# Altium project Speaker Mic Comms.PrjPcb
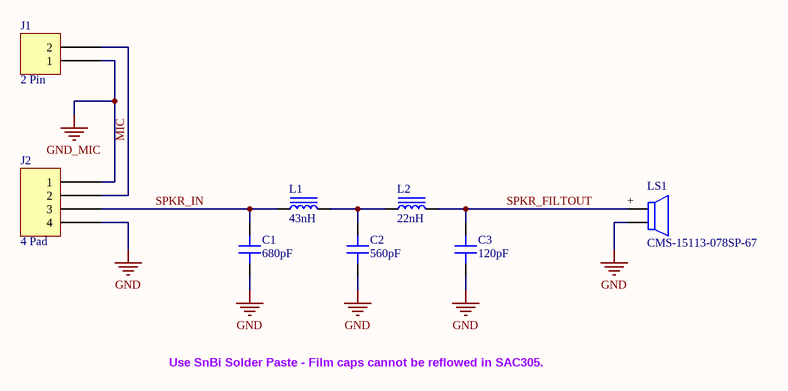
[diagram p0: Mic Speaker Interconn.SchDoc]
1 sheet, 8 parts. Net scope: global (net labels, ports and power ports of the same name join across sheets).
Board file: Mic Speaker Interconnect.PcbDoc

## Sheet Mic Speaker Interconn.SchDoc: Microphone and Speaker Interconnect
size A4

### Parts
C1  680pF  [CAP FILM 0603_1608]
C2  560pF  [CAP FILM 0603_1608]
C3  120pF  [CAP FILM 0603_1608]
J1  2 Pin  [Mic2Board]
J2  4 Pad  [Wire2Board]
L1  43nH  [IND 0603_1608 RF WW]
L2  22nH  [IND 0603_1608 RF WW]
LS1  CMS-15113-078SP-67  [CUI CMS-15113-078SP]

### Nets
GND: C1.1 C2.1 C3.1 J2.4 LS1.-
GND_MIC: J1.1 J2.1
MIC: J1.2 J2.2
SPKR_FILTOUT: C3.2 L2.2 LS1.+
SPKR_IN: C1.2 J2.3 L1.1
NetC2_2: C2.2 L1.2 L2.1

### Notes on the sheet
- Use SnBi Solder Paste - Film caps cannot be reflowed in SAC305.
- Title
- Size:
- Date:
- A4
- Number:
- Time:
- Revision:
- Sheet
- of
- File:

### Library data of the parts
C1 = ECH-U1C681GX5: CAP FILM 680PF 2% 16VDC 0603; Manufacturer: Panasonic Electronic Components; Dielectric Material: Polyphenylene Sulfide (PPS), Metallized - Stacked; Voltage Rating - DC: 16V; Part Number: ECH-U1C681GX5; Applications: General Purpose; Capacitance: 680pF; ComponentLink1Description: Datasheet; ComponentLink1URL: http://industrial.panasonic.com/www-cgi/jvcr13pz.cgi?E+PZ+3+ABD0013+ECHU1C681GX5+7+WW; ComponentLink2Description: DigiKey Link; ComponentLink2URL: http://digikey.com/product-detail/en/panasonic-electronic-components/ECH-U1C681GX5/PCF1451CT-ND/431710; Device Package: 0603 (1608 Metric); Height - Seated (Max): 0.033" (0.85mm); LastUpdated: 06/09/2020 12:17:15; Lifecycle Status: Active; Minimum Order: 1; Mounting Type: Surface Mount; Operating Temperature: -55°C ~ 125°C; Package / Case: 0603 (1608 Metric); Packaging: TapeAndReel; Part Status: Active; Price: 0.11; Series: ECH-U(X); Size / Dimension: 0.063" L x 0.031" W (1.60mm x 0.80mm); Supplier 1: DigiKey; Supplier Part Number 1: PCF1451CT-ND; Termination: Solder Pads; Tolerance: ±2%; Value: 680pF
C2 = ECH-U1C561JX5: CAP FILM 560PF 5% 16VDC 0603; Manufacturer: Panasonic Electronic Components; Dielectric Material: Polyphenylene Sulfide (PPS), Metallized - Stacked; Voltage Rating - DC: 16V; Part Number: ECH-U1C561JX5; Applications: General Purpose; Capacitance: 560pF; ComponentLink1Description: Datasheet; ComponentLink1URL: http://industrial.panasonic.com/www-cgi/jvcr13pz.cgi?E+PZ+3+ABD0013+ECHU1C561JX5+7+WW; ComponentLink2Description: DigiKey Link; ComponentLink2URL: http://digikey.com/product-detail/en/panasonic-electronic-components/ECH-U1C561JX5/PCF1468CT-ND/431709; Device Package: 0603 (1608 Metric); Height - Seated (Max): 0.033" (0.85mm); LastUpdated: 06/09/2020 12:17:15; Lifecycle Status: Active; Minimum Order: 1; Mounting Type: Surface Mount; Operating Temperature: -55°C ~ 125°C; Package / Case: 0603 (1608 Metric); Packaging: TapeAndReel; Part Status: Active; Price: 0.12; Series: ECH-U(X); Size / Dimension: 0.063" L x 0.031" W (1.60mm x 0.80mm); Supplier 1: DigiKey; Supplier Part Number 1: PCF1468CT-ND; Termination: Solder Pads; Tolerance: ±5%; Value: 560pF
C3 = ECH-U1C121JX5: CAP FILM 120PF 5% 16VDC 0603; Manufacturer: Panasonic Electronic Components; Dielectric Material: Polyphenylene Sulfide (PPS), Metallized - Stacked; Voltage Rating - DC: 16V; Part Number: ECH-U1C121JX5; Applications: General Purpose; Capacitance: 120pF; ComponentLink1Description: Datasheet; ComponentLink1URL: http://industrial.panasonic.com/www-cgi/jvcr13pz.cgi?E+PZ+3+ABD0013+ECHU1C121JX5+7+WW; ComponentLink2Description: DigiKey Link; ComponentLink2URL: http://digikey.com/product-detail/en/panasonic-electronic-components/ECH-U1C121JX5/PCF1460CT-ND/431693; Device Package: 0603 (1608 Metric); Height - Seated (Max): 0.033" (0.85mm); LastUpdated: 06/09/2020 12:17:15; Lifecycle Status: Active; Minimum Order: 1; Mounting Type: Surface Mount; Operating Temperature: -55°C ~ 125°C; Package / Case: 0603 (1608 Metric); Packaging: TapeAndReel; Part Status: Active; Price: 0.11; Series: ECH-U(X); Size / Dimension: 0.063" L x 0.031" W (1.60mm x 0.80mm); Supplier 1: DigiKey; Supplier Part Number 1: PCF1460CT-ND; Termination: Solder Pads; Tolerance: ±5%; Value: 120pF
J2 = 4 Pin
L1 = LQW18AN43NJ8ZD: FIXED IND 43NH 840MA 210 MOHM; Manufacturer: Murata Electronics; DC Resistance (DCR): 210mOhm Max; Frequency - Self Resonant: 2.78GHz; Inductance Frequency - Test: 100MHz; Material - Core: Non-Magnetic; Q @ Freq: 40 @ 250MHz; Shielding: Unshielded; Tolerance: ±5%; Type: Wirewound; Part Number: LQW18AN43NJ8ZD; ComponentLink1Description: Datasheet; ComponentLink1URL: https://search.murata.co.jp/Ceramy/image/img/P02/JELF243A-9133.pdf; ComponentLink2Description: DigiKey Link; ComponentLink2URL: http://digikey.com/product-detail/en/murata-electronics/LQW18AN43NJ8ZD/490-15692-1-ND/6800357; Current Rating (Amps): 840mA; Device Package: 0603 (1608 Metric); Height - Seated (Max): 0.039" (1.00mm); Inductance: 43nH; LastUpdated: 06/09/2020 11:05:19; Lifecycle Status: Active; Minimum Order: 1; Mounting Type: Surface Mount; Operating Temperature: -55°C ~ 125°C; Package / Case: 0603 (1608 Metric); Packaging: TapeAndReel; PartId: 1154; Part Status: Active; Price: 0.09; Ratings: AEC-Q200; Series: LQW18; Size / Dimension: 0.063" L x 0.031" W (1.60mm x 0.80mm); Supplier 1: DigiKey; Supplier Part Number 1: 490-15692-1-ND; Supplier Device Package: 0603 (1608 Metric); Value: 43nH
L2 = LQW18AN22NG8ZD: FIXED IND 22NH 1.3A 86 MOHM; Manufacturer: Murata Electronics; DC Resistance (DCR): 86mOhm Max; Frequency - Self Resonant: 3.45GHz; Inductance Frequency - Test: 100MHz; Material - Core: Non-Magnetic; Q @ Freq: 40 @ 250MHz; Shielding: Unshielded; Tolerance: ±2%; Type: Wirewound; Part Number: LQW18AN22NG8ZD; ComponentLink1Description: Datasheet; ComponentLink1URL: https://search.murata.co.jp/Ceramy/image/img/P02/JELF243A-9133.pdf; ComponentLink2Description: DigiKey Link; ComponentLink2URL: http://digikey.com/product-detail/en/murata-electronics/LQW18AN22NG8ZD/490-15658-1-ND/6800323; Current Rating (Amps): 1.3A; Device Package: 0603 (1608 Metric); Height - Seated (Max): 0.039" (1.00mm); Inductance: 22nH; LastUpdated: 06/09/2020 11:05:20; Lifecycle Status: Active; Minimum Order: 1; Mounting Type: Surface Mount; Operating Temperature: -55°C ~ 125°C; Package / Case: 0603 (1608 Metric); Packaging: TapeAndReel; PartId: 1273; Part Status: Active; Price: 0.10; Ratings: AEC-Q200; Series: LQW18; Size / Dimension: 0.063" L x 0.031" W (1.60mm x 0.80mm); Supplier 1: DigiKey; Supplier Part Number 1: 490-15658-1-ND; Supplier Device Package: 0603 (1608 Metric); Value: 22nH
LS1 = CMS-15113-078SP-67: SPEAKER, 15 X 11 MM, 3 MM DEEP,; Manufacturer: CUI Devices; Efficiency - dBA: 91.00; Efficiency - Testing: 700mW/100mm; Efficiency - Type: Sound Pressure Level (SPL); Frequency Range: 100Hz ~ 20kHz; Frequency - Self Resonant: 700Hz; Impedance: 8 Ohms; Ingress Protection: IP67 - Dust Tight, Waterproof; Material - Cone: Polyester, Polyethylene Terephthalate (PET); Material - Magnet: Nd-Fe-B; Port Location: Top; Power - Max: 1W; Power - Rated: 700mW; Shape: Rectangular; Part Number: CMS-15113-078SP-67; ComponentLink1Description: Datasheet; ComponentLink1URL: https://www.cuidevices.com/product/resource/digikeypdf/cms-15113-078x-67.pdf; ComponentLink2Description: DigiKey Link; ComponentLink2URL: http://digikey.com/product-detail/en/cui-devices/CMS-15113-078SP-67/102-5001-ND/9561103; Height - Seated (Max): 0.118" (3.00mm); LastUpdated: 06/09/2020 11:52:13; Lifecycle Status: Active; Minimum Order: 1; Packaging: Tray; Part Status: Active; Price: 2.17; Series: CMS; Size / Dimension: 0.591" L x 0.433" W (15.00mm x 11.00mm); Supplier 1: DigiKey; Supplier Part Number 1: 102-5001-ND; Technology: Magnetic; Termination: Solder Pads; Type: General Purpose